# EAGLE schematic tactile_push_button_smd (EAGLE 9.2.2)
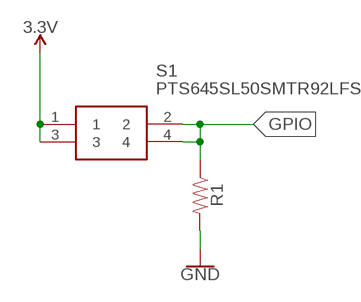
[diagram p0: schematic, sheet 1]

## Parts
R1  RESISTOR1206  [1206]
S1  PTS645SL50SMTR92LFS  [PTS645SMT]

## Nets
3.3V: S1.1 S1.3
GND: R1.2
GPIO: R1.1 S1.2 S1.4

## Library data of the parts
R1 = SparkFun-Resistors:RESISTOR: Generic Resistor Package
S1 = PTS645SL50SMTR92LFS:PTS645SL50SMTR92LFS: PTS645SL50SMTR92LFS (Tactile Switches) Source: Datasheet <https://www.ckswitches.com/media/1471/pts645.pdf>; DESCRIPTION: PTS645SL50SMTR92LFS (Tactile Switches); HEIGHT: mm; MANUFACTURER_NAME: C & K COMPONENTS; MANUFACTURER_PART_NUMBER: PTS645SL50SMTR92LFS; MOUSER_PART_NUMBER: 611-PTS645SL50SMTR92; MOUSER_PRICE-STOCK: https://www.mouser.com/Search/Refine.aspx?Keyword=611-PTS645SL50SMTR92